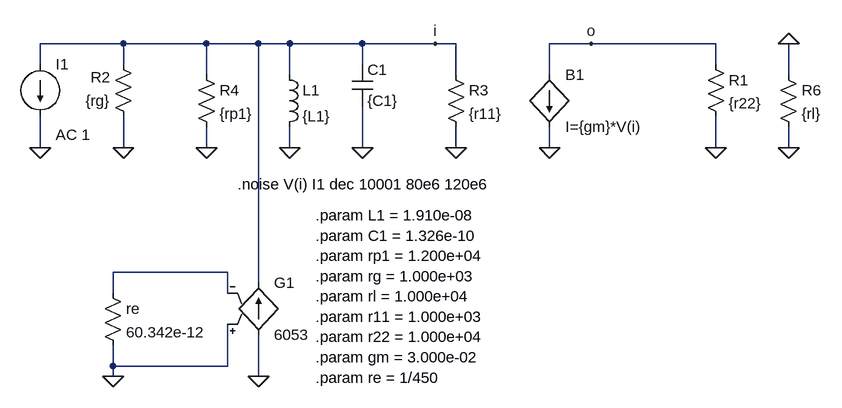
[diagram p0: schematic sintonizado.asc]
sintonizado.asc, the LTspice schematic file:
Version 4
SHEET 1 1776 692
WIRE -80 96 -208 96
WIRE 48 96 -80 96
WIRE 128 96 48 96
WIRE 176 96 128 96
WIRE 288 96 176 96
WIRE 400 96 288 96
WIRE 432 96 400 96
WIRE 640 96 576 96
WIRE 832 96 640 96
WIRE -208 128 -208 96
WIRE -80 128 -80 96
WIRE 288 128 288 96
WIRE 832 128 832 96
WIRE 48 144 48 96
WIRE 176 144 176 96
WIRE 432 144 432 96
WIRE 576 144 576 96
WIRE 944 144 944 96
WIRE -208 256 -208 208
WIRE -80 256 -80 208
WIRE 48 256 48 224
WIRE 176 256 176 224
WIRE 288 256 288 192
WIRE 432 256 432 224
WIRE 576 256 576 224
WIRE 832 256 832 208
WIRE 944 256 944 224
WIRE 80 448 -96 448
WIRE 128 464 128 96
WIRE -96 480 -96 448
WIRE 80 480 80 448
WIRE -96 592 -96 560
WIRE 80 592 80 528
WIRE 80 592 -96 592
WIRE -96 608 -96 592
WIRE 128 608 128 544
FLAG -208 256 0
FLAG 288 256 0
FLAG 176 256 0
FLAG 576 256 0
FLAG 432 256 0
FLAG 832 256 0
FLAG 640 96 o
FLAG 400 96 i
FLAG 48 256 0
FLAG -80 256 0
FLAG 128 608 0
FLAG -96 608 0
FLAG 944 256 0
FLAG 944 96 0
SYMBOL cap 272 128 R0
SYMATTR InstName C1
SYMATTR Value {C1}
SYMATTR SpiceLine Irms=0
SYMBOL ind 160 128 R0
SYMATTR InstName L1
SYMATTR Value {L1}
SYMATTR SpiceLine Rser=0
SYMBOL res 416 128 R0
SYMATTR InstName R3
SYMATTR Value {r11}
SYMBOL bi 576 144 R0
SYMATTR InstName B1
SYMATTR Value I={gm}*V(i)
SYMBOL res 816 112 R0
SYMATTR InstName R1
SYMATTR Value {r22}
SYMBOL res -64 224 R180
WINDOW 0 36 76 Left 2
WINDOW 3 36 40 Left 2
SYMATTR InstName R2
SYMATTR Value {rg}
SYMBOL res 32 128 R0
SYMATTR InstName R4
SYMATTR Value {rp1}
SYMBOL current -208 128 R0
WINDOW 123 24 108 Left 2
WINDOW 39 0 0 Left 2
SYMATTR Value2 AC 1
SYMATTR InstName I1
SYMATTR Value ""
SYMBOL g2 128 448 R0
SYMATTR InstName G1
SYMATTR Value 6053
SYMBOL res -112 464 R0
SYMATTR InstName re
SYMATTR Value 60.342e-12
SYMBOL res 928 128 R0
SYMATTR InstName R6
SYMATTR Value {rl}
TEXT 96 312 Left 2 !.noise V(i) I1 dec 10001 80e6 120e6
TEXT 216 360 Left 2 !.param L1 = 1.910e-08\n.param C1 = 1.326e-10\n.param rp1 = 1.200e+04\n.param rg = 1.000e+03\n.param rl = 1.000e+04\n.param r11 = 1.000e+03\n.param r22 = 1.000e+04\n.param gm = 3.000e-02\n.param re = 1/450

The netlist it stands for:
* sintonizado.asc
C1 i 0 {C1} Irms=0
L1 i 0 {L1} Rser=0
R3 i 0 {r11}
B1 o 0 I={gm}*V(i)
R1 o 0 {r22}
R2 0 i {rg}
R4 i 0 {rp1}
I1 i 0 AC 1
G1 0 i 0 N001 6053
re N001 0 60.342e-12
R6 0 0 {rl}
.noise V(i) I1 dec 10001 80e6 120e6
.param L1 = 1.910e-08
.param C1 = 1.326e-10
.param rp1 = 1.200e+04
.param rg = 1.000e+03
.param rl = 1.000e+04
.param r11 = 1.000e+03
.param r22 = 1.000e+04
.param gm = 3.000e-02
.param re = 1/450
.backanno
.end